# EAGLE design ode_qt_ex (EAGLE 9.6.2)
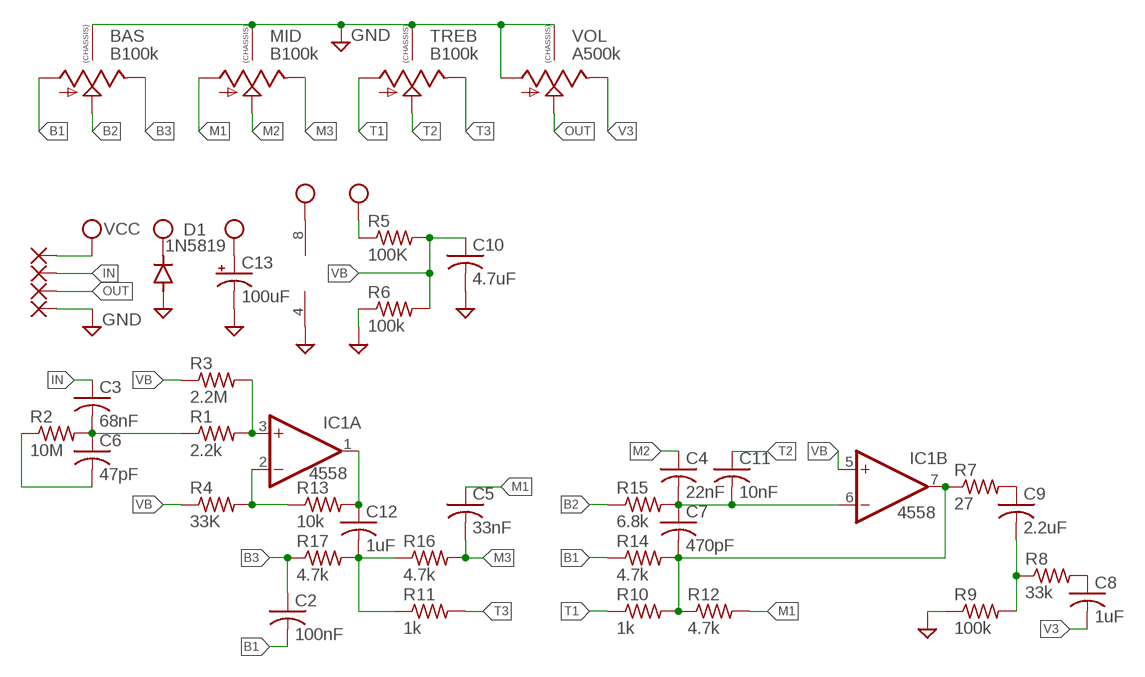
[diagram p0: schematic, sheet 1]

## Parts
BAS  B100k  9MM_SNAP-IN_POT_CHASSIS  [9MM_SNAP-IN_POT]
C2  100nF  C-USC0603  [C0603]
C3  68nF  C-USC0603  [C0603]
C4  22nF  C-USC0603  [C0603]
C5  33nF  C-USC0603  [C0603]
C6  47pF  C-USC0603  [C0603]
C7  470pF  C-USC0603  [C0603]
C8  1uF  C-USC0603  [C0603]
C9  2.2uF  C-USC0805  [C0805]
C10  4.7uF  C-USC0805  [C0805]
C11  10nF  C-USC0603  [C0603]
C12  1uF  C-USC0603  [C0603]
C13  100uF  100UF-POLAR-RADIAL-2.5MM-25V-20%  [CPOL-RADIAL-2.5MM-6.5MM]
D1  1N5819  DIODE-SOD123  [SOD123]
IC1  4558  LM4558D  [SO08]
MID  B100k  9MM_SNAP-IN_POT_CHASSIS  [9MM_SNAP-IN_POT]
PAD1  1,6/0,8  [1,6/0,8]
PAD2  1,6/0,8  [1,6/0,8]
PAD3  1,6/0,8  [1,6/0,8]
PAD4  1,6/0,8  [1,6/0,8]
R1  2.2k  R-US_R0603  [R0603]
R2  10M  R-US_R0603  [R0603]
R3  2.2M  R-US_R0603  [R0603]
R4  33K  R-US_R0603  [R0603]
R5  100K  R-US_R0603  [R0603]
R6  100k  R-US_R0603  [R0603]
R7  27  R-US_R0603  [R0603]
R8  33k  R-US_R0603  [R0603]
R9  100k  R-US_R0603  [R0603]
R10  1k  R-US_R0603  [R0603]
R11  1k  R-US_R0603  [R0603]
R12  4.7k  R-US_R0603  [R0603]
R13  10k  R-US_R0603  [R0603]
R14  4.7k  R-US_R0603  [R0603]
R15  6.8k  R-US_R0603  [R0603]
R16  4.7k  R-US_R0603  [R0603]
R17  4.7k  R-US_R0603  [R0603]
TREB  B100k  9MM_SNAP-IN_POT_CHASSIS  [9MM_SNAP-IN_POT]
VOL  A500k  9MM_SNAP-IN_POT_CHASSIS  [9MM_SNAP-IN_POT]

## Nets
B1: BAS.1(A) C2.2 R14.1
B2: BAS.2(S) R15.1
B3: BAS.3(E) C2.1 R17.1
GND: BAS.CHASSIS1 BAS.CHASSIS2 C10.2 C13.2(-) D1.A IC1.4(P:V-) MID.CHASSIS1 MID.CHASSIS2 PAD4.1(P) R6.1 R9.1 TREB.CHASSIS1 TREB.CHASSIS2 VOL.1(A) VOL.CHASSIS1 VOL.CHASSIS2
IN: C3.1 PAD2.1(P)
M1: C5.1 MID.1(A) R12.2
M2: C4.1 MID.2(S)
M3: C5.2 MID.3(E) R16.2
N$2: C3.2 C6.1 R1.1 R2.2
N$3: C6.2 R2.1
N$4: IC1.3(A:+IN) R1.2 R3.2
N$5: C12.1 IC1.1(A:OUT) R13.2
N$6: IC1.2(A:-IN) R4.2 R13.1
N$7: C12.2 R11.1 R16.1 R17.2
N$8: C4.2 C7.1 C11.2 IC1.6(B:-IN) R15.2
N$9: C7.2 IC1.7(B:OUT) R7.1 R10.2 R12.1 R14.2
N$10: C9.1 R7.2
N$11: C9.2 R8.1 R9.2
N$12: C8.1 R8.2
OUT: PAD3.1(P) VOL.2(S)
T1: R10.1 TREB.1(A)
T2: C11.1 TREB.2(S)
T3: R11.2 TREB.3(E)
V3: C8.2 VOL.3(E)
VB: C10.1 IC1.5(B:+IN) R3.1 R4.1 R5.2 R6.2
VCC: C13.1(+) D1.C IC1.8(P:V+) PAD1.1(P) R5.1

## Library data of the parts
BAS MID TREB VOL = MusicThingModular:9MM_SNAP-IN_POT_CHASSIS: 9mm vertical snap-in pot, Alpha / Panasonic style, with a connection to the metal chassis for grounding
C2-C12 = adafruit:C-US: CAPACITOR, American symbol
C13 = SparkFun-Capacitors:100UF-POLAR: 100µF polarized capacitors A capacitor is a passive two-terminal electrical component used to store electrical energy temporarily in an electric field.; PROD_ID: CAP-08439
D1 = diode:DIODE-: DIODE
IC1 = linear:*4558: OP AMP
PAD1-PAD4 = wirepad:1,6/0,8: THROUGH-HOLE PAD
R1-R17 = adafruit:R-US_: RESISTOR, American symbol

## Board
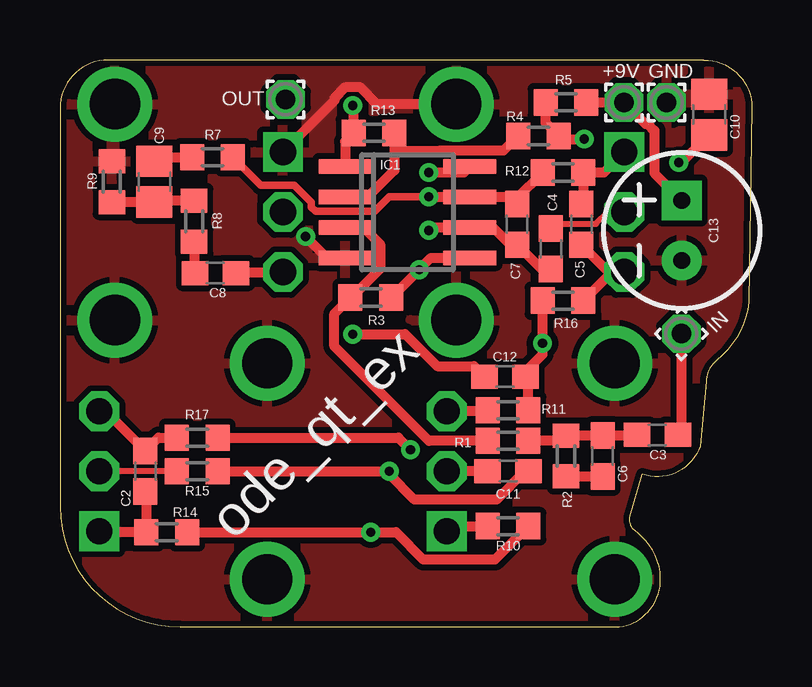
[diagram p1: board, top side]
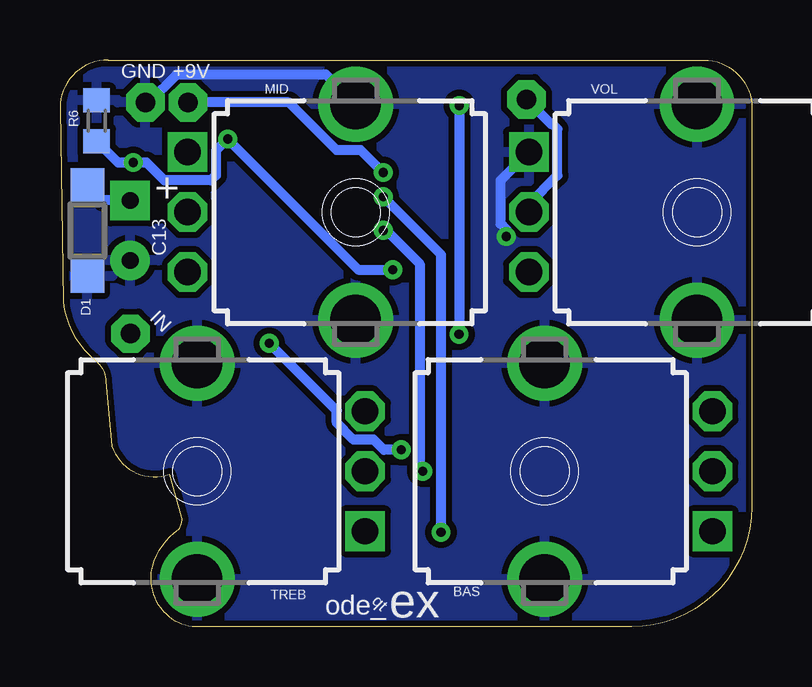
[diagram p2: board, bottom side, seen from below]

Size 28.83 x 23.61 mm. Coordinates in mm from the lower left corner, seen from the top.
Outline: 0,21.61 0,5 arc90 5,0 22.86,0 23.16,0 arc45 24.38,0.51 arc45 25.02,1.86 25.02,2.28 arc45 23.88,4.06 arc-45 23.75,4.55 24.26,6.35 arc90 26.67,7.53 26.92,10.22 arc-45 27.26,11 27.35,11.1 arc45 28.7,13.53 28.83,21.62 arc90 26.83,23.61 2,23.61 arc90 0,21.61
Copper layers (1*16): Top 0.035mm / dielectric 1.5mm / Bottom 0.035mm
Design rules "default *": minimum track width 6mil, minimum drill 0.35mm, track to track 6mil, track to pad 6mil, pad to pad 6mil, via to via 6mil, smd to smd 6mil, copper to edge 10mil, drill to drill 6mil, minimum pad ring 10mil, minimum via ring 8mil, stop-mask expansion 4mil, vias tented up to drill 0mil, thermal gap 10mil

### Footprints (pad centres in the part's own frame; a part is rotated, then mirrored left to right if it is on the bottom)
9MM_SNAP-IN_POT = drill 1.1 square: 1 -2.5,-7 | drill 1.1 octagon: 2 0,-7; 3 2.5,-7 | drill 2.1 pad 2.794: CHASSIS1 -4.5,0; CHASSIS2 4.5,0
C0603 = smd 1.1 x 1: 1 -0.85,0; 2 0.85,0
C0805 = smd 1.3 x 1.5: 1 -0.85,0; 2 0.85,0
CPOL-RADIAL-2.5MM-6.5MM = drill 0.7 pad 1.651 square: 1 1.25,0 | drill 0.7 pad 1.651: 2 -1.25,0
SOD123 = smd 1.4 x 1.4: A 1.9,0; C -1.9,0
SO08 = smd 0.6 x 2.2: 1 -1.905,-2.6; 2 -0.635,-2.6; 3 0.635,-2.6; 4 1.905,-2.6; 5 1.905,2.6; 6 0.635,2.6; 7 -0.635,2.6; 8 -1.905,2.6
1,6/0,8 = drill 0.813 pad 1.6 octagon: 1 0,0
R0603 = smd 1 x 1.1: 1 -0.85,0; 2 0.85,0

### Placement (x,y rotation side)
BAS  8.64,6.48 90 bottom
C2  3.56,6.48 270 top
C3  24.89,8 180 top
C4  20.45,15.75 270 top
C5  21.72,16.76 270 top
C6  22.61,7.11 270 top
C7  19.05,16.76 90 top
C8  6.48,14.73 0 top
C9  3.94,18.54 270 top
C10  27.05,21.34 90 top
C11  18.67,6.48 0 top
C12  18.54,10.41 0 top
C13  25.91,16.51 90 top
D1  27.69,16.51 270 bottom
IC1  14.48,17.27 270 top
MID  16.51,17.27 270 bottom
PAD1  23.5,21.84 0 top
PAD2  25.89,12.21 45 top
PAD3  9.4,21.97 0 top
PAD4  25.27,21.84 0 top
R1  18.67,7.75 180 top
R2  21.08,7.11 90 top
R3  12.95,13.72 180 top
R4  19.94,20.45 180 top
R5  21.08,21.84 180 top
R6  27.3,21.08 270 bottom
R7  6.35,19.56 180 top
R8  5.59,16.89 270 top
R9  2.16,18.54 270 top
R10  18.67,4.19 0 top
R11  18.67,9.02 180 top
R12  20.95,18.92 0 top
R13  13.08,20.57 180 top
R14  4.45,3.94 0 top
R15  5.71,6.48 0 top
R16  20.95,13.59 0 top
R17  5.71,7.87 0 top
TREB  23.11,6.48 90 bottom
VOL  2.29,17.27 270 bottom

### Tracks (layer width: path | path; a pad name or v marks a point on that pad's centre or on a via)
B1
  Top 0.406: BAS.1 1.68,3.94 R14.1 3.6,5.59 C2.2
B2
  Top 0.254: R15.1 BAS.2
B3
  Top 0.406: BAS.3 1.91,8.98 C2.1 4.1,7.87 R17.1
GND  (via drill 0.38)
  Top 0.406: MID.CHASSIS1 13.2,21.77 12.5,22.47 11.88,22.47 11.44,22.03 11.44,21.93 VOL.1 | IC1.4 11.12,15.37 v10.23,16.26
  Bottom 0.406: PAD4.1 25.13,21.84 23.97,23 17.74,23 MID.CHASSIS1 | v10.23,16.26 10.23,16.55 10.47,16.78 10.47,18.59 VOL.1
  pour Top (isolate 0.254): -1.27,25.4 -1.27,-1.27 30.48,-1.27 30.48,25.4
  pour Bottom (isolate 0.254): -1.27,25.4 -1.27,-1.27 30.48,-1.27 30.48,25.4
IN
  Top 0.406: PAD2.1 25.89,8.15 C3.1
M1
  Top 0.406: MID.1 22.66,18.92 R12.2 21.8,17.7 C5.1
M2
  Top 0.254: C4.1 20.63,16.79 22.33,16.79 22.82,17.27 MID.2
M3
  Top 0.406: R16.2 22.99,14.77 MID.3 22.86,14.77 C5.2
N$2
  Top 0.406: C3.2 24,7.96 C6.1 R2.2 20.87,7.75 R1.1
N$3
  Top 0.406: R2.1 C6.2
N$4
  Top 0.406: R1.2 15.37,7.75 11.43,11.68 11.43,13.04 R3.2 12.13,13.72 13.33,14.92 13.33,15.94 12.64,16.64 IC1.3
N$5  (via drill 0.38)
  Top 0.406: IC1.1 11.88,20.22 R13.2 12.23,21.68 v12.19,21.72 | C12.1 17.25,10.86 15.72,10.86 14.38,12.19 v12.21,12.19
  Bottom 0.406: v12.19,21.72 12.19,12.21 v12.21,12.19
N$6
  Top 0.406: R13.1 13.93,19.81 | 13.93,19.81 13.93,19.01 12.83,17.91 IC1.2 | 13.93,19.81 15.81,19.81 15.83,19.83 18.48,19.83 R4.2
N$7  (via drill 0.38)
  Top 0.406: R11.1 19.52,10.29 C12.2 19.39,10.63 20.11,11.34 v20.11,11.81 R16.1 | R17.2 14.1,7.87 v14.61,7.37
  Bottom 0.406: v14.61,7.37 15.33,7.37 15.76,7.8 16.6,7.8 17.3,8.49 17.3,9 v20.11,11.81
N$8  (via drill 0.38)
  Top 0.406: C4.2 20.07,14.9 C7.1 18.76,15.91 18.03,16.64 IC1.6 15.49,16.64 v15.37,16.51 | C11.2 19.37,6.48 18.19,5.3 14.77,5.3 13.72,6.35 v13.72,6.48 R15.2
  Bottom 0.406: v13.72,6.48 13.84,6.6 13.84,15.11 15.24,16.51 v15.37,16.51
N$9  (via drill 0.38)
  Top 0.305: R7.1 8.36,18.4 9.75,18.4 10.47,17.68 10.47,17.48 10.65,17.3 13.1,17.3 13.71,17.91 v15.37,17.91
  Top 0.406: R12.1 19.05,17.87 C7.2 18.76,17.91 IC1.7 v15.37,17.91 | R14.2 v12.95,3.94 14,3.94 15.14,2.8 18.12,2.8 R10.2
  Bottom 0.406: v12.95,3.94 12.95,15.49 v15.37,17.91
N$10
  Top 0.406: C9.1 4.1,19.56 R7.2
N$11
  Top 0.406: C9.2 3.81,17.69 | 3.81,17.69 R9.2 | R8.1 3.86,17.74 3.81,17.69
N$12
  Top 0.406: R8.2 5.59,14.77 C8.1
OUT
  Bottom 0.406: VOL.2 9.29,17.62 8.11,18.8 8.11,20.74 8.31,20.95 8.38,20.95 PAD3.1
T1
  Top 0.406: TREB.1 16.33,4.19 R10.1
T2
  Top 0.406: C11.1 TREB.2
T3
  Top 0.406: R11.2 17.78,8.98 TREB.3
V3
  Top 0.406: C8.2 7.37,14.77 VOL.3
VB  (via drill 0.38)
  Top 0.406: R5.2 20.23,21 R4.1 20.92,20.32 v21.84,20.32 | R3.1 v14.97,14.88 15.46,15.37 IC1.5 | C10.1 25.91,19.34 v25.78,19.34
  Bottom 0.406: R6.2 26.42,19.34 v25.78,19.34 25.23,19.34 24.48,18.59 22.54,18.59 22.33,18.8 22.33,19.84 v21.84,20.32 16.4,14.88 v14.97,14.88
VCC  (via drill 0.38)
  Top 0.406: R5.1 PAD1.1 24.39,20.95 24.48,20.95 24.77,20.67 24.77,18.9 C13.1 | IC1.8 16.82,18.92 v15.37,18.92
  Bottom 0.406: v15.37,18.92 16.3,19.86 17.3,19.86 19.29,21.84 PAD1.1 | C13.1 27.04,17.76 D1.C

### Text on the board
tPlace: +9V | GND | OUT | IN | ode_qt_ex
bPlace: +9V | GND | + | C13 | IN | qt | ode_ | ex